# Altium schematic sheet Reid Orthotic v2 MCU.SchDoc: CAL1020 MCU
size A4; DrawnBy: Alex Gilmour; DocumentNumber: 3; Revision: v2; SheetNumber: 3; SheetTotal: 5; PageSetup: Record=PageOptions|CenterHorizontal=True|CenterVertical=True|PrintScale=0.73|XCorrection=1.00|YCorrection=1.00|PrintKind=0|BorderSize=5000000|LeftOffset=0|BottomOffset=0|Orientation=2|PaperLength=1000|PaperWidth=1000|Scale=100|PaperSource=7|PrintQuality=-3|MediaType=1|DitherType=10|PrintScaleMode=1|PaperKind=A4|PaperIndex=9
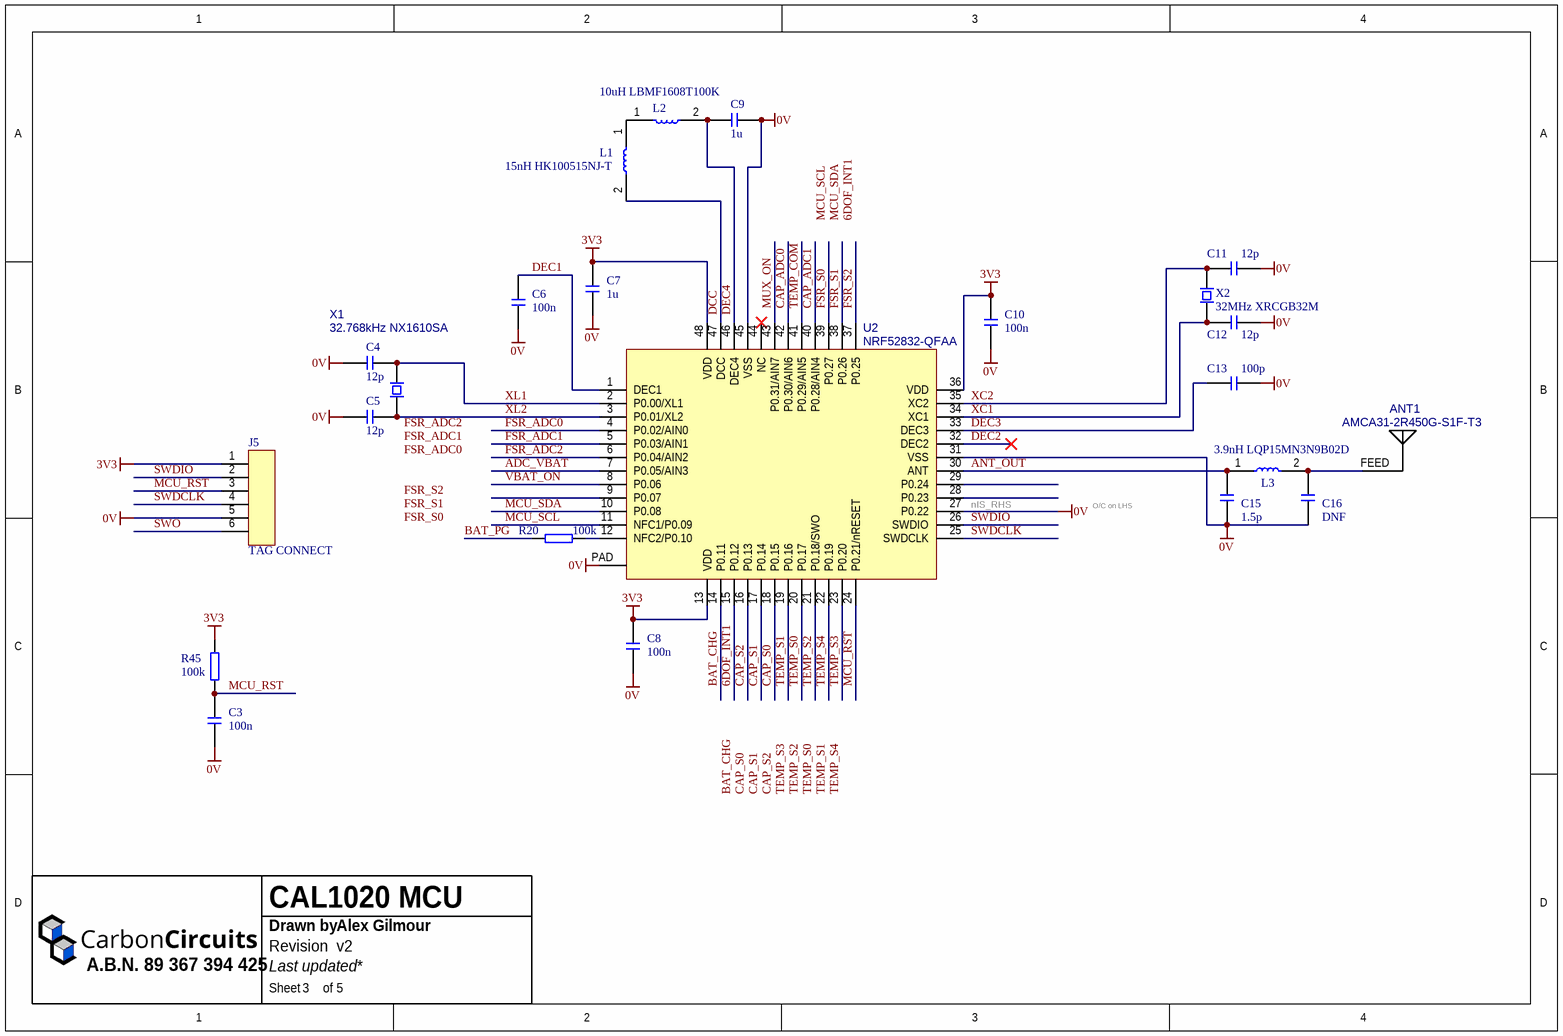
[diagram p0: Reid Orthotic v2 MCU.SchDoc]

## Parts
ANT1  AMCA31-2R450G-S1F-T3  [RFANT3216120A5T]
C3  100n  [0402 CAP HD]
C4  12p  [0402 CAP HD]
C5  12p  [0402 CAP HD]
C6  100n  [0402 CAP HD]
C7  1u  [0402 CAP HD]
C8  100n  [0402 CAP HD]
C9  1u  [0402 CAP HD]
C10  100n  [0402 CAP HD]
C11  12p  [0402 CAP HD]
C12  12p  [0402 CAP HD]
C13  100p  [0402 CAP HD]
C15  1.5p  [0402 CAP HD]
C16  DNF  [0402 CAP HD]
J5  TAG CONNECT  [TC2030-NL]  (no BOM)
L1  15nH HK100515NJ-T  [0402 HD]
L2  10uH LBMF1608T100K  [0603 HD]
L3  3.9nH LQP15MN3N9B02D  [0402 HD]
R20  100k  [0402 RES HD]
R45  100k  [0402 RES HD]
U2  NRF52832-QFAA  [NRF52832-QFAA]
X1  32.768kHz NX1610SA  [CRYSTAL NDK NX1610SA]
X2  32MHz XRCGB32M  [XTAL 2016]

## Nets
0V: C3.1 C4.2 C5.2 C6.1 C7.1 C8.1 C9.1 C10.1 C11.1 C12.1 C13.1 C15.1 C16.1 J5.5 U2.27(P0.22) U2.31(VSS) U2.45(VSS) U2.PAD
3V3: C7.2 C8.2 C10.2 J5.1 R45.2 U2.13(VDD) U2.36(VDD) U2.48(VDD)
6DOF_INT1: U2.15(P0.12)
ADC_VBAT: U2.7(P0.05/AIN3)
ANT_OUT: C15.2 L3.1 U2.30(ANT)
BAT_CHG: U2.14(P0.11)
BAT_PG: R20.2
CAP_ADC0: U2.42(P0.30/AIN6)
CAP_ADC1: U2.40(P0.28/AIN4)
CAP_S0: U2.18(P0.15)
CAP_S1: U2.17(P0.14)
CAP_S2: U2.16(P0.13)
DCC: L1.2 U2.47(DCC)
DEC1: C6.2 U2.1(DEC1)
DEC2: U2.32(DEC2)
DEC3: C13.2 U2.33(DEC3)
DEC4: C9.2 L2.2 U2.46(DEC4)
FSR_ADC0: U2.4(P0.02/AIN0)
FSR_ADC1: U2.5(P0.03/AIN1)
FSR_ADC2: U2.6(P0.04/AIN2)
FSR_S0: U2.39(P0.27)
FSR_S1: U2.38(P0.26)
FSR_S2: U2.37(P0.25)
MCU_RST: C3.2 J5.3 R45.1 U2.24(P0.21/nRESET)
MCU_SCL: U2.11(NFC1/P0.09)
MCU_SDA: U2.10(P0.08)
MUX_ON: U2.43(P0.31/AIN7)
SWDCLK: J5.4 U2.25(SWDCLK)
SWDIO: J5.2 U2.26(SWDIO)
SWO: J5.6
TEMP_COM: U2.41(P0.29/AIN5)
TEMP_S0: U2.20(P0.17)
TEMP_S1: U2.19(P0.16)
TEMP_S2: U2.21(P0.18/SWO)
TEMP_S3: U2.23(P0.20)
TEMP_S4: U2.22(P0.19)
VBAT_ON: U2.8(P0.06)
XC1: C12.2 U2.34(XC1) X2.1
XC2: C11.2 U2.35(XC2) X2.2
XL1: C4.1 U2.2(P0.00/XL1) X1.1
XL2: C5.1 U2.3(P0.01/XL2) X1.2
NetANT1_FEED: ANT1.FEED C16.2 L3.2
NetL1_1: L1.1 L2.1
NetR20_1: R20.1 U2.12(NFC2/P0.10)

Not connected (* = marked no-connect by the designer): U2 9(P0.07) 28(P0.23) 29(P0.24) 44(NC)*

## Notes on the sheet
- (near U2) nIS_RHS
- O/C on LHS
- Labels drawn without touching a wire or pin: 6DOF_INT1, BAT_CHG, CAP_S0, CAP_S1, CAP_S2, FSR_ADC0, FSR_ADC1, FSR_ADC2, FSR_S0, FSR_S1, FSR_S2, MCU_SCL, MCU_SDA, TEMP_S0, TEMP_S1, TEMP_S2, TEMP_S3, TEMP_S4
- A.B.N. 89 367 394 425
- Revision
- Drawn by
- Last updated
- Sheet
- of

## Library data of the parts
ANT1 = Antenna
C3-C13 C15 C16 = Capacitor
J5 = CON 6POS
L1-L3 = Inductor
R20 R45 = Resistor
X1 = Crystal 32.768kHz
X2 = Crystal